# Altium project Solar_charger_MPPT.PrjPcb
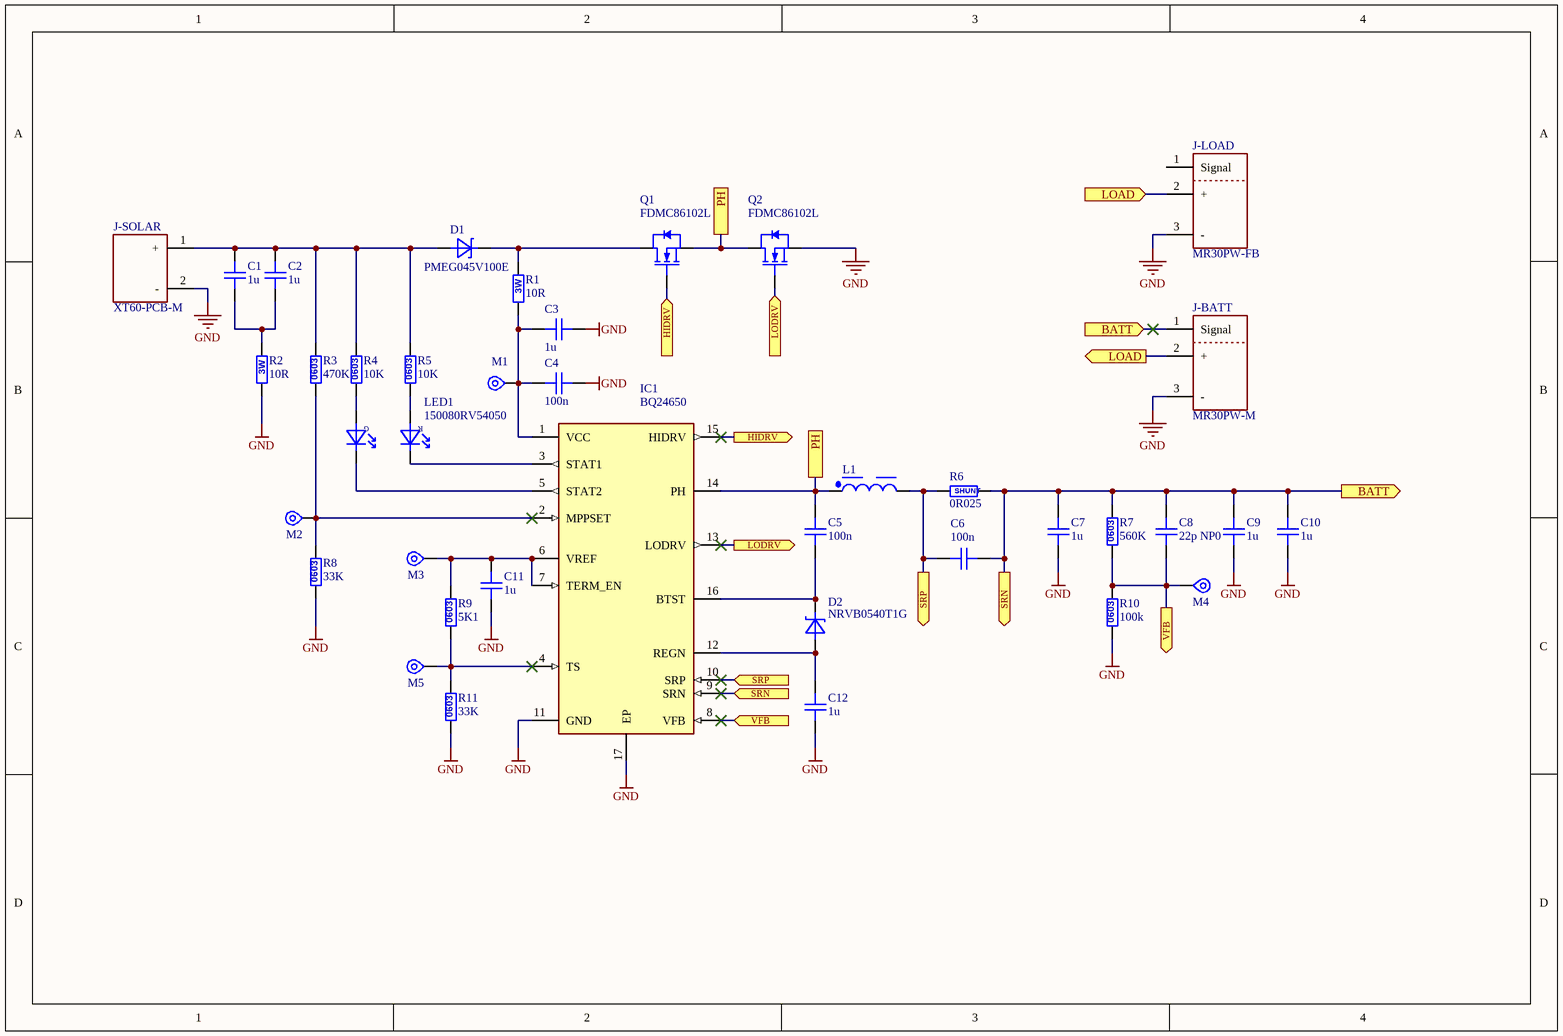
[diagram p0: Schematic.SchDoc]
1 sheet, 38 parts. Net scope: flat (ports and power ports of the same name join across sheets).
Board file: PCB.PcbDoc

## Sheet Schematic.SchDoc
size A4; SheetNumber: 1; SheetTotal: 1

### Parts
C1  value 1u  [C1206_medium]  (hidden comment: C1206C105K5RACTU)
C2  value 1u  [C1206_medium]  (hidden comment: C1206C105K5RACTU)
C3  value 1u  [C1206_medium]  (hidden comment: C1206C105K5RACTU)
C4  value 100n  [C0603]  (hidden comment: 06035C104K4Z2A)
C5  value 100n  [C0603]  (hidden comment: 06035C104K4Z2A)
C6  value 100n  [C0603]  (hidden comment: 06035C104K4Z2A)
C7  value 1u  [C1206_medium]  (hidden comment: C1206C105K5RACTU)
C8  value 22p NP0  [C0603]  (hidden comment: CC0603JRNPO9BN220)
C9  value 1u  [C1206_medium]  (hidden comment: C1206C105K5RACTU)
C10  value 1u  [C1206_medium]  (hidden comment: C1206C105K5RACTU)
C11  value 1u  [C1206_medium]  (hidden comment: C1206C105K5RACTU)
C12  value 1u  [C1206_medium]  (hidden comment: C1206C105K5RACTU)
D1  value PMEG045V100E  [SOT1289]  (hidden comment: PMEG045V100EIPE-QZ)
D2  NRVB0540T1G  [SOD123HP]
IC1  BQ24650  [QFN50P350X350X100-17N]
J-BATT  MR30PW-M  [MR30PW-M]
J-LOAD  MR30PW-FB  [MR30PW-FB]
J-SOLAR  XT60-PCB-M  [XT60-PCB-M]
L1  10uH, 7.1A  [WE-PD_1210]  (value not drawn)
LED1  150080RV54050  [LED-GREEN-RED]
M1  TP  [Pad 1mm SMD]  (value not drawn)  (no BOM)
M2  TP  [Pad 1mm SMD]  (value not drawn)  (no BOM)
M3  TP  [Pad 1mm SMD]  (value not drawn)  (no BOM)
M4  TP  [Pad 1mm SMD]  (value not drawn)  (no BOM)
M5  TP  [Pad 1mm SMD]  (value not drawn)  (no BOM)
Q1  FDMC86102L  [PowerPak1212_LFPAK33]
Q2  FDMC86102L  [PowerPak1212_LFPAK33]
R1  value 10R  [RESC6331X70N]  (hidden comment: 352210RFT)
R2  value 10R  [RESC6331X70N]  (hidden comment: 352210RFT)
R3  value 470K  [R0603]  (hidden comment: CRGCQ0603F470K)
R4  value 10K  [R0603]  (hidden comment: CRGP0603F10K)
R5  value 10K  [R0603]  (hidden comment: CRGP0603F10K)
R6  value 0R025  [Shunt_2512]  (hidden comment: CS121WF250MT2E)
R7  value 560K  [R0603]  (hidden comment: SFR03EZPF5603)
R8  value 33K  [R0603]  (hidden comment: CRGCQ0603F33K)
R9  value 5K1  [R0603]  (hidden comment: SFR03EZPF5101)
R10  value 100k  [R0603]  (hidden comment: RC0603FR-07100KL)
R11  value 33K  [R0603]  (hidden comment: CRGCQ0603F33K)

### Ports
BATT (in, see Schematic[4B]), BATT (out, see Schematic[3B]), HIDRV (in, see Schematic[2B]), HIDRV (out, see Schematic[2B]), LOAD (in, see Schematic[3B]), LOAD (out, see Schematic[3A]), LODRV (in, see Schematic[2C]), LODRV (out, see Schematic[2B]), PH (see Schematic[2A]), PH (see Schematic[3B]), SRN (in, see Schematic[3C]), SRN (out, see Schematic[2C]), SRP (in, see Schematic[3C]), SRP (out, see Schematic[2C]), VFB (in, see Schematic[3C]), VFB (out, see Schematic[2C])

### Nets
GND: C3.1 C4.1 C7.1 C9.1 C10.1 C11.2 C12.1 IC1.11(GND) IC1.17(EP) J-BATT.3(-) J-LOAD.3(-) J-SOLAR.2(-) Q2.1,_2,_3(SOURCE) R2.2 R8.2 R10.2 R11.2
NetC1_1: C1.1 C2.1 D1.1,_2(A) J-SOLAR.1(+) R3.1 R4.1 R5.1
NetC1_2: C1.2 C2.2 R2.1
NetC3_2: C3.2 C4.2 IC1.1(VCC) M1.1 R1.2
NetC5_1: C5.1 D2.2(C) IC1.16(BTST)
NetC5_2: C5.2 IC1.14(PH) L1.1 Q1.1,_2,_3(SOURCE) Q2.5(DRAIN) ; port PH
NetC6_1: C6.1 IC1.10(SRP) L1.2 R6.1 ; port SRP
NetC6_2: C6.2 C7.2 C8.1 C9.2 C10.2 IC1.9(SRN) J-BATT.1(Signal) R6.2 R7.1 ; port SRN, port BATT
NetC8_2: C8.2 IC1.8(VFB) M4.1 R7.2 R10.1 ; port VFB
NetC11_1: C11.1 IC1.6(VREF) IC1.7(TERM_EN) M3.1 R9.1
NetC12_2: C12.2 D2.1(A) IC1.12(REGN)
NetD1_3: D1.3(K) Q1.5(DRAIN) R1.1
NetIC1_2: IC1.2(MPPSET) M2.1 R3.2 R8.1
NetIC1_3: IC1.3(STAT1) LED1.1(C2)
NetIC1_4: IC1.4(TS) M5.1 R9.2 R11.1
NetIC1_5: IC1.5(STAT2) LED1.2(C1)
NetIC1_13: IC1.13(LODRV) Q2.4(GATE) ; port LODRV
NetIC1_15: IC1.15(HIDRV) Q1.4(GATE) ; port HIDRV
NetJ-BATT_2: J-BATT.2(+) J-LOAD.2(+) ; port LOAD
NetLED1_3: LED1.3(A1) R4.2
NetLED1_4: LED1.4(A2) R5.2

Not connected (* = marked no-connect by the designer): J-LOAD 1(Signal)

### Notes on the sheet
- (in symbol 150080RV54050) G; R
- (in symbol CR_0603_103) 0603
- (in symbol CR_0603_104) 0603
- (in symbol CR_0603_333) 0603
- (in symbol CR_0603_474) 0603
- (in symbol CR_0603_512) 0603
- (in symbol CR_0603_564) 0603
- (in symbol CR_2512_10R) 3W
- (in symbol SHUNT_2512_0R025) SHUNT

### Library data of the parts
C1-C3 C7 C9-C12 = CC_1206_X7R_105: Ceramic Capacitor X7R 50V; Supplier 1: Mouser; Supplier Part Number 1: 81-GCJ31MR71H105KA2L; Supplier 2: Digi-Key; Supplier Part Number 2: 490-5810-1-ND; Supplier 3: Farnell; Supplier Part Number 3: 2781416
C4-C6 = CC_0603_X7R_104: Ceramic Capacitor X7R 50V; Part Number: 100n/50V X7R C0603; SMD/THD: SMD; Main: Capacitors; Status: A; Category: Capacitors CERA SMD; Manufacturer Part Number: 100n/50V X7R C0603; Component Type: Capacitors; Supplier 1: Mouser; Supplier 2: Farnell; Supplier Part Number 1: 581-06035C104K4Z2A; Supplier Part Number 2: 1833843
C8 = CC_0603_NP0_220: Ceramic Capacitor NP0 50V; Part Number: 22p/50V NPO C0603; Main: Capacitors; SMD/THD: SMD; Status: A; Category: Capacitors CERA SMD; Component Type: Capacitors; Supplier 1: Mouser; Supplier 2: Farnell; Supplier 3: TME; Supplier Part Number 2: 722005; Supplier Part Number 1: 603-CC603JRNPO9BN220; Supplier Part Number 3: CC0603JRNPO9220
D1 = PMEG045V100E: Planar Low VF Schottky barrier rectifier 45V/10A; Part Number: PMEG4005AEA; Manufacturer: NXP; SMD/THD: SMD; Main: Diodes; ComponentLink1URL: http://www.farnell.com/datasheets/684565.pdf; ComponentLink1Description: Datasheet; Category: Schottky; Status: A; Supplier 1: Mouser; Supplier 2: Digi-Key; Supplier 3: Farnell; Supplier Part Number 1: 771-PMEG4005AESFYL; Supplier Part Number 2: 1727-2295-1-ND; Supplier Part Number 3: 2498560
D2 = NRVB0540T1G: Schottky Diode 40V, 500mA; SMD/THD: SMD; Main: Diodes; Category: Schottky; Status: A; Supplier 1: Mouser; Supplier Part Number 1: 863-NRVB0540T1G; Supplier 2: Farnell; Supplier Part Number 2: 2723913; Value: NRVB0540T1G
IC1 = BQ24650: Charge Management: Lead Acid, Lithium Iron Phosphate (LiFePO4), Lithium-ion, Lithium Polymer / + 85°C/ -40° C; Supplier 1: Mouser; Supplier Part Number 1: 595-BQ24650RVAT; Supplier 2: Digikey; Supplier Part Number 2: 296-27699-1-ND
J-BATT = MR30PW-M: Connector; Supplier 1: TME; Supplier Part Number 1: MR30PW-M
J-LOAD = MR30PW-FB: Connector; Supplier 1: TME; Supplier Part Number 1: MR30PW-FB
J-SOLAR = XT60-PCB-M: XT60 Connector; Manufacturer_Name: Amass; Manufacturer_Part_Number: XT30PB; Datasheet Link: https://www.tme.eu/Document/4acc913878197f8c2e30d4b8cdc47230/XT30UPB%20SPEC.pdf; Height: 10.7mm
L1 = 7447709100: WE-PD SMT Power Inductor, size 1210, 10uH, 7.1A, 21mOhm; Manufacturer: Wurth Elektronik; Case/Size Code: 1210; DC Resistance: 13mOhm; Saturation Current: 10.5A; Self Resonant Frequency: 21MHz; Type: Standard; Manufacturer Part Number: 7447709100; Category: Power Inductors; Match Code: WE-PD; ComponentLink1Description: Website Link; ComponentLink1URL: https://www.we-online.com/redexpert/article/7447709100?ad; ComponentLink2Description: Datasheet Link; ComponentLink2URL: https://www.we-online.com/redexpert/spec/7447709100?ad; Mount: Surface Mount; Min Operating Temperature: -40°C; Max Operating Temperature: 125°C; Packaging: Tape and Reel; Length: 12mm; Width: 12mm; Height: 10mm; DC Resistance Max: 21mOhm; Inductance: 10uH; Rated Current: 7.1A
LED1 = 150080RV54050: SMD Bi-Color LED Green Red; Manufacturer: Wurth Elektronik; Main: Diodes; Status: A; Value: Green Red; Part Number: 150080RV54050; Category: LED; ComponentLink1URL: https://cz.mouser.com/datasheet/2/445/150080RV54050-1838969.pdf; ComponentLink1Description: Datasheet; SMD/THD: SMD; Supplier 1: Mouser; Supplier Part Number 1: 710-150080RV54050; Supplier 2: Digi-Key; Supplier Part Number 2: 732-150080RV54050CT-ND
M1-M5 = TP_PCB: Test Point; Main: Mechanical; Category: Pads_Pins_Measure_Points; Stock number: --------; Component Type: Mechanical
Q1 Q2 = FDMC86102L: Single N-Channel 100V, 18A, 23mOhm; Manufacturer: ON Semiconductor / Fairchild; Main: Transistors; SMD/THD: SMD; Category: N-MOS; ComponentLink1Description: Datasheet; ComponentLink1URL: http://www.farnell.com/datasheets/1837750.pdf; Status: A; Part Number: FDMC86102L; Manufacturer Part Number: FDMC86102L; Component Type: Transistors; Supplier 1: Mouser; Supplier Part Number 1: 512-FDMC86102L; Supplier 2: Digi-Key; Supplier Part Number 2: FDMC86102LFSCT-ND; Value: FDMC86102L
R1 R2 = CR_2512_10R: Resistor 1%, 3W, 250V; SMD/THD: SMD; Main: Resistors; Status: A; Category: Resistors SMD; Component Type: Resistors; Supplier 1: Mouser; Supplier Part Number 1: 279-352210RFT; Supplier 2: Digi-Key; Supplier Part Number 2: A121123CT-ND
R3 = CR_0603_474: Resistor 1%, 0.1W, 75V; SMD/THD: SMD; Main: Resistors; Status: A; Category: Resistors SMD; Component Type: Resistors; Supplier 1: Mouser; Supplier 2: Digi-Key; Supplier 3: TME; Supplier Part Number 2: A129720CT-ND; Supplier Part Number 1: 279-CRGCQ0603F470K; Supplier Part Number 3: CRGCQ0603F470K
R4 R5 = CR_0603_103: Resistor 1%, 0.1W, 75V; SMD/THD: SMD; Main: Resistors; Status: A; Category: Resistors SMD; Component Type: Resistors; Supplier 1: Mouser; Supplier 2: Digi-Key; Supplier 3: Farnell; Supplier Part Number 3: 2861046; Supplier Part Number 2: A130428CT-ND; Supplier Part Number 1: 279-CRGP0603F10K
R6 = SHUNT_2512_0R025: Current Sense Resistor 1%, 1W; SMD/THD: SMD; Main: Resistors; Status: A; Category: Resistors SMD; Component Type: Resistors; Supplier 1: TME; Supplier Part Number 1: CS2512N4-0R025-1%
R7 = CR_0603_564: Resistor 1%, 0.1W, 75V; SMD/THD: SMD; Main: Resistors; Status: A; Category: Resistors SMD; Component Type: Resistors; Supplier 1: Mouser; Supplier 2: Digi-Key; Supplier Part Number 1: 755-SFR03EZPF5603; Supplier Part Number 2: 511-SFR03EZPF5603CT-ND
R8 R11 = CR_0603_333: Resistor 1%, 0.1W, 75V; SMD/THD: SMD; Main: Resistors; Status: A; Category: Resistors SMD; Component Type: Resistors; Supplier 1: Digi-Key; Supplier 2: Mouser; Supplier 3: TME; Supplier Part Number 1: A129706CT-ND; Supplier Part Number 2: 279-CRGCQ0603F33K; Supplier Part Number 3: CRGCQ0603F33K
R9 = CR_0603_512: Resistor 1%, 0.1W, 75V; SMD/THD: SMD; Main: Resistors; Status: A; Category: Resistors SMD; Component Type: Resistors; Supplier 1: Mouser; Supplier Part Number 1: 755-SFR03EZPF5101; Supplier 2: Digi-Key; Supplier Part Number 2: 511-SFR03EZPF5101CT-ND
R10 = CR_0603_104: Resistor 1%, 0.1W, 75V; SMD/THD: SMD; Main: Resistors; Status: A; Category: Resistors SMD; Component Type: Resistors; Supplier 1: Mouser; Supplier 2: Farnell; Supplier 3: TME; Supplier Part Number 2: 9238727; Supplier Part Number 1: 603-RC0603FR-07100KL; Supplier Part Number 3: RC0603FR-07100K